# EAGLE design Character ID Transmiter xbee (EAGLE 6.4)
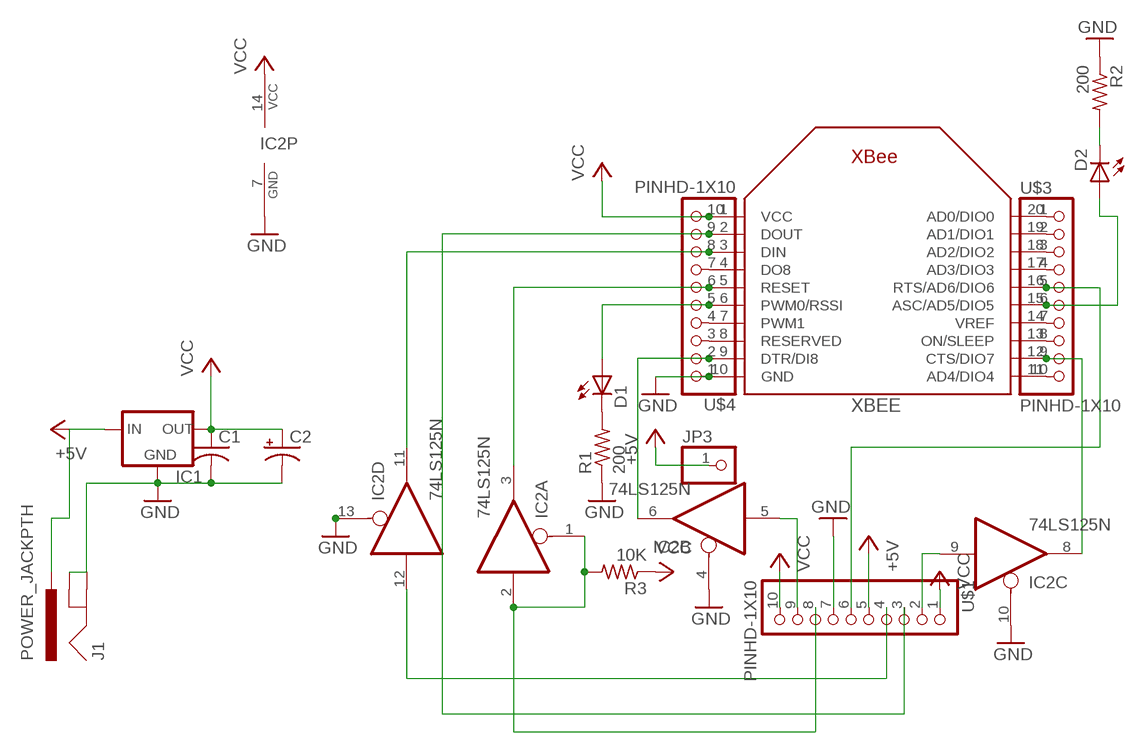
[diagram p0: schematic, sheet 1]

## Parts
C1  C-US025-025X050  [C025-025X050]
C2  CPOL-USE2.5-5  [E2,5-5]
D1  LED3MM  [LED3MM]
D2  LED3MM  [LED3MM]
IC1  MC1700  [TO92]
IC2  74LS125N  [DIL14]
J1  POWER_JACKPTH  [POWER_JACK_PTH]
JP3  PINHD-1X1  [1X01]
R1  200  R-US_0207/10  [0207/10]
R2  200  R-US_0207/10  [0207/10]
R3  10K  R-US_0207/10  [0207/10]
U$1  PINHD-1X10  [1X10-BIG]
U$3  PINHD-1X10  [1X10-BIG]
U$4  PINHD-1X10  [1X10-BIG]
XBEE  XBEE  [XBEE]

## Nets
+5V: IC1.2(IN) J1.PWR JP3.1 U$1.5
GND: C1.2 C2.- IC1.1(GND) IC2.4(B:OE) IC2.7(P:GND) IC2.10(C:OE) IC2.13(D:OE) J1.GND J1.GNDBREAK R1.1 R2.1 U$1.7 U$4.1 XBEE.10(GND)
N$1: IC2.12(D:I) U$1.4
N$2: IC2.11(D:O) U$4.8 XBEE.3(DIN)
N$3: IC2.5(B:I) U$1.9
N$4: IC2.8(C:O) U$3.9 XBEE.12(CTS/DIO7)
N$5: D2.K(C) R2.2
N$6: U$4.7 XBEE.4(DO8)
N$7: D1.A U$4.5 XBEE.6(PWM0/RSSI)
N$8: D1.K(C) R1.2
N$9: D2.A U$3.6 XBEE.15(ASC/AD5/DIO5)
N$10: IC2.6(B:O) U$4.2 XBEE.9(DTR/DI8)
N$11: U$4.3 XBEE.8(RESERVED)
N$12: U$4.4 XBEE.7(PWM1)
N$13: IC2.3(A:O) U$4.6 XBEE.5(RESET)
N$14: U$3.1 XBEE.20(AD0/DIO0)
N$15: U$3.2 XBEE.19(AD1/DIO1)
N$16: U$3.3 XBEE.18(AD2/DIO2)
N$17: U$3.4 XBEE.17(AD3/DIO3)
N$18: U$3.7 XBEE.14(VREF)
N$19: U$3.8 XBEE.13(ON/SLEEP)
N$20: U$3.10 XBEE.11(AD4/DIO4)
N$21: IC2.9(C:I) U$1.2
RESET: IC2.1(A:OE) IC2.2(A:I) R3.2 U$1.8
RTS: U$1.6 U$3.5 XBEE.16(RTS/AD6/DIO6)
TX: U$1.3 U$4.9 XBEE.2(DOUT)
VCC: C1.1 C2.+ IC1.3(OUT) IC2.14(P:VCC) R3.1 U$1.1 U$1.10 U$4.10 XBEE.1(VCC)

## Library data of the parts
C1 = rcl-ez:C-US: CAPACITOR, American symbol
C2 = rcl-ez:CPOL-US: POLARIZED CAPACITOR, American symbol
D1 D2 = minimidi:LED: LED OSRAM: - CHIPLED LG R971, LG N971, LY N971, LG Q971, LY Q971, LO R971, LY R971 LH N974, LH R974 LS Q976, LO Q976, LY Q976 LO Q996 - Hyper CHIPLED LW Q18S LB Q993, LB Q99A, LB R99A - SideLED LS A670, LO A670, LY A670, LG A670, LP A670 LB A673, LV A673, LT A673, LW A673 LH A674 LY A675 LS A676, LA A676, LO A676, LY A676, LW A676 LS A679, LY A679, LG A679 - Hyper Micro SIDELED® LS Y876, LA Y876, LO Y876, LY Y876 LT Y87S - SmartLED LW L88C, LW L88S LB L89C, LB L89S, LG L890 LS L89K, LO L89K, LY L89K LS L896, LA L896, LO L896, LY L896 - TOPLED LS T670, LO T670, LY T670, LG T670, LP T670 LSG T670, LSP T670, LSY T670, LOP T670, LYG T670 LG T671, LOG T671, LSG T671 LB T673, LV T673, LT T673, LW T673 LH T674 LS T676, LA T676, LO T676, LY T676, LB T676, LH T676, LSB T676, LW T676 LB T67C, LV T67C, LT T67C, LS T67K, LO T67K, LY T67K, LW E67C LS E67B, LA E67B, LO E67B, LY E67B, LB E67C, LV E67C, LT E67C LW T67C LS T679, LY T679, LG T679 LS T770, LO T770, LY T770, LG T770, LP T770 LB T773, LV T773, LT T773, LW T773 LH T774 LS E675, LA E675, LY E675, LS T675 LS T776, LA T776, LO T776, LY T776, LB T776 LHGB T686 LT T68C, LB T68C - Hyper Mini TOPLED® LB M676 - Mini TOPLED Santana® LG M470 LS M47K, LO M47K, LY M47K Source: http://www.osram.convergy.de/
IC1 = ulink:MC1700: VOLTAGE REGULATOR
IC2 = 74xx-us:74*125: Quad bus BUFFER, 3-state
J1 = SparkFun-Connectors:POWER_JACK: Power Jack This is the standard 5.5mm barrel jack for power. The PTH is the most common, proven, reliable, footprint. All others are experimental. The Slot footprint only works if the mill layer is transmitted to the PCB fab house so be warned. Spark Fun Electronics SKU : PRT-00119. Mating wall wart : TOL-00298 (and others)
JP3 = digg:PINHD-1X1: PIN HEADER
R1-R3 = rcl-ez:R-US_: RESISTOR, American symbol
U$1 U$3 U$4 = ybox2:PINHD-1X10
XBEE = ulink:XBEE

## Board
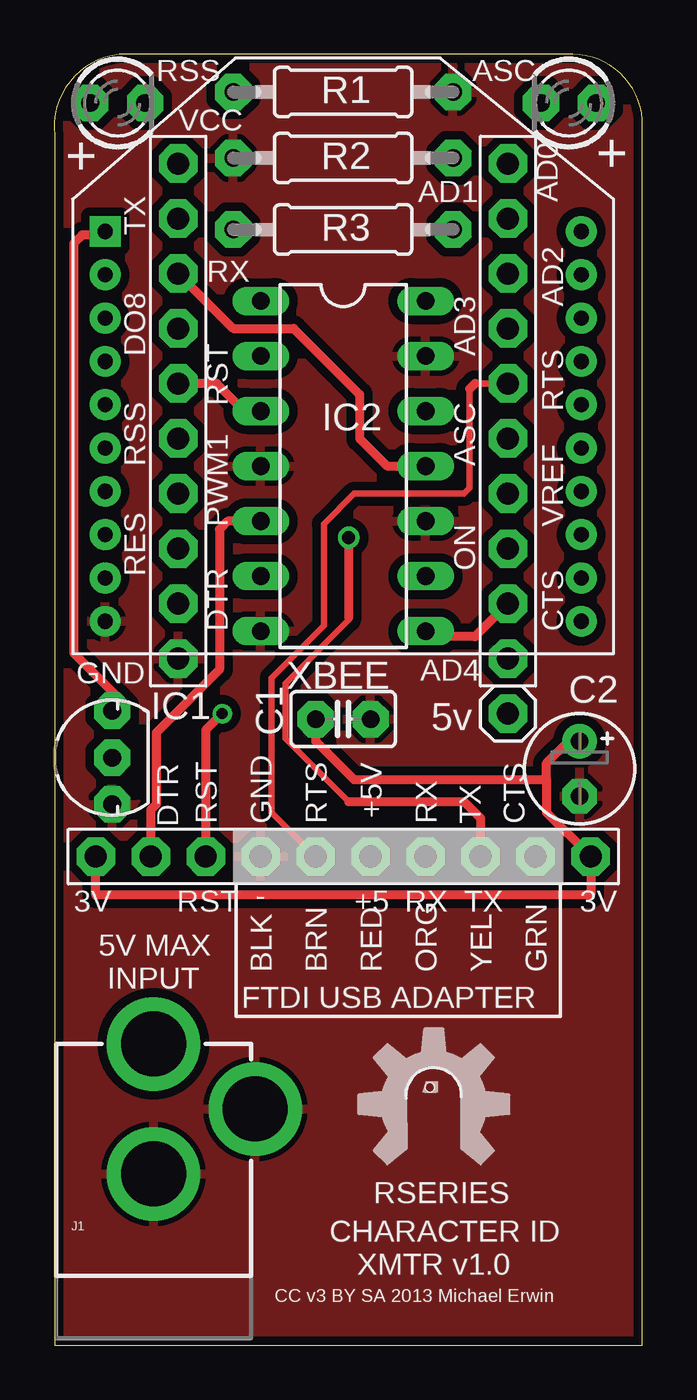
[diagram p1: board, top side]
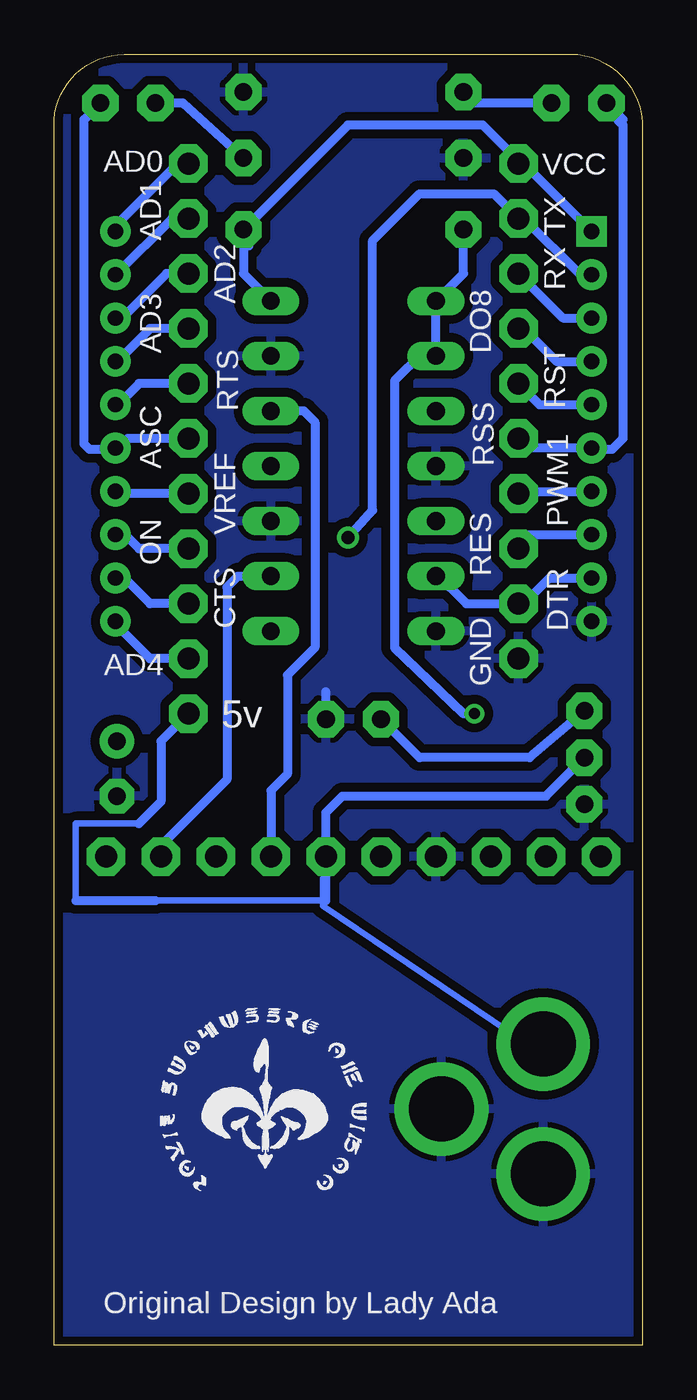
[diagram p2: board, bottom side, seen from below]

Size 27.18 x 59.62 mm. Coordinates in mm from the lower left corner, seen from the top.
Outline: 0.02,0 27.18,0 27.18,56.59 arc90 23.65,59.61 3,59.61 arc90 0.02,55.88 0.02,0
Copper layers (1*16): Top 0.035mm / dielectric 1.5mm / Bottom 0.035mm
Design rules "default": minimum track width 12mil, minimum drill 19mil, track to track 12mil, track to pad 12mil, pad to pad 12mil, via to via 12mil, smd to smd 0mil, copper to edge 10mil, drill to drill 8mil, minimum pad ring 10mil, minimum via ring 8mil, stop-mask expansion 4mil, vias tented up to drill 0mil, thermal gap 10mil

### Footprints (pad centres in the part's own frame; a part is rotated, then mirrored left to right if it is on the bottom)
C025-025X050 = drill 0.813 pad 1.676 octagon: 1 -1.27,0; 2 1.27,0
E2,5-5 = drill 0.813 pad 1.6: + -1.27,0 | drill 0.813 pad 1.6 octagon: - 1.27,0
LED3MM = drill 0.813 pad 1.676 octagon: A -1.27,0; K 1.27,0
TO92 = drill 0.813 pad 1.676 octagon: 1 -2.159,0; 2 0,0; 3 2.159,0
DIL14 = drill 0.813 long: 1 -7.62,-3.81; 2 -5.08,-3.81; 3 -2.54,-3.81; 4 0,-3.81; 5 2.54,-3.81; 6 5.08,-3.81; 7 7.62,-3.81; 8 7.62,3.81; 9 5.08,3.81; 10 2.54,3.81; 11 0,3.81; 12 -2.54,3.81; 13 -5.08,3.81; 14 -7.62,3.81
POWER_JACK_PTH = drill 2.997 pad 4.318: GND 0,7.7; GNDBREAK 4.7,10.7; PWR 0,13.7
1X01 = drill 1.016 pad 1.778 octagon: 1 0,0
0207/10 = drill 0.813 pad 1.676 octagon: 1 -5.08,0; 2 5.08,0
1X10-BIG = drill 1.016 pad 1.778 octagon: 1 -11.43,0; 2 -8.89,0; 3 -6.35,0; 4 -3.81,0; 5 -1.27,0; 6 1.27,0; 7 3.81,0; 8 6.35,0; 9 8.89,0; 10 11.43,0
XBEE = drill 0.7 pad 1.422 square: 1 -11,5.5 | drill 0.7 pad 1.422: 2 -11,3.5; 3 -11,1.5; 4 -11,-0.5; 5 -11,-2.5; 6 -11,-4.5; 7 -11,-6.5; 8 -11,-8.5; 9 -11,-10.5; 10 -11,-12.5; 11 11,-12.5; 12 11,-10.5; 13 11,-8.5; 14 11,-6.5; 15 11,-4.5; 16 11,-2.5; 17 11,-0.5; 18 11,1.5; 19 11,3.5; 20 11,5.5

### Placement (x,y rotation side)
C1  13.35,28.92 0 top
C2  24.27,26.63 270 top
D1  2.94,57.37 0 top
D2  23.77,57.37 180 top
IC1  2.68,27.14 90 top
IC2  13.35,40.6 270 top
J1  4.59,0.22 0 top
JP3  20.97,29.17 0 top
R1  13.35,57.87 180 top
R2  13.35,54.83 0 top
R3  13.35,51.52 180 top
U$1  13.35,22.57 180 top
U$2  [RSERIES-OSHW-LOGO-LARGE]  17.54,11.14 0 top
U$3  20.97,43.14 270 top
U$4  5.73,43.14 90 top
U$5  [ROYAL-ENGINEERS-OF-NABOO-SMALL]  22.37,6.82 0 bottom
XBEE  13.35,45.94 0 top

### Tracks (layer width: path | path; a pad name or v marks a point on that pad's centre or on a via)
+5V
  Top 0.152: J1.PWR 4.84,13.92 4.84,13.93
  Bottom 0.305: JP3.1 21.48,28.66 | 22.5,20.54 14.62,20.54 | 23.26,24.09 26.18,24.09 26.18,20.54 | J1.PWR 5.35,13.93 14.75,20.28 14.75,21.55 14.62,21.55
  Bottom 0.406: 14.62,20.54 14.62,21.55 U$1.5 14.62,24.6 13.86,25.36 4.46,25.36 IC1.2 | 21.48,28.66 22.24,27.9 22.24,25.11 23.26,24.09 | 26.18,20.54 22.5,20.54
GND
  Bottom 0.406: C1.2 14.62,30.19
  pour Bottom (isolate 0.406): 0.14,-0.04 27.32,-0.04 27.32,59.65 -0.11,59.65
  pour Top (isolate 0.406): 0.14,-0.04 27.32,-0.04 27.32,59.65 -0.11,59.65
N$1
  Bottom 0.406: IC2.12 15.64,43.14 15.13,42.63 15.13,32.22 16.4,30.95 16.4,26.38 17.16,25.62 U$1.4
N$2
  Top 0.406: 17.42,40.6 IC2.11 15.38,40.6 14.11,41.87 14.11,43.9 11.07,46.95 8.27,46.95 U$4.8
  Bottom 0.406: XBEE.3 3.68,47.44 U$4.8
N$3
  Top 0.406: IC2.5 8.02,38.06 7.64,37.68 7.64,31.2 4.72,28.28 4.72,24.98 4.46,24.73 U$1.9
N$4
  Top 0.406: IC2.8 17.42,32.73 19.45,32.73 U$3.9
  Bottom 0.406: XBEE.12 24.11,35.44 24.02,35.52 22.75,34.25 U$3.9
N$5
  Bottom 0.406: R2.2 21.23,57.37 D2.K
N$6
  Bottom 0.406: XBEE.4 3.96,45.44 5.48,46.95 5.48,47.21 5.73,47.21 | 5.99,47.21 5.73,47.21 | 5.73,47.21 U$4.7
N$7
  Bottom 0.406: 1.03,56.73 0.91,56.6 | D1.A 1.03,56.73 | U$4.5 5.3,41.44 XBEE.6 2.28,41.36 1.41,41.36 0.91,41.87 0.91,56.35 1.16,56.6 1.03,56.73
N$8
  Bottom 0.406: R1.2 8.02,57.37 D1.K
N$9
  Bottom 0.406: D2.A 25.8,56.6 25.8,41.62 25.54,41.36 24.42,41.36 XBEE.15 24.27,41.36 23.77,41.87 U$3.6
N$10
  Bottom 0.406: XBEE.9 4.29,35.44 5.48,34.25 U$4.2 8.14,34.25 9.54,35.65 IC2.6
N$11
  Bottom 0.406: U$4.3 5.99,36.79 5.34,37.44 XBEE.8
N$12
  Bottom 0.406: XBEE.7 5.63,39.44 U$4.4
N$13
  Top 0.406: U$4.6 7.51,44.41 8.78,43.14 IC2.3
  Bottom 0.406: XBEE.5 4.76,43.44 U$4.6
N$14
  Bottom 0.406: XBEE.20 24.44,51.44 24.53,51.52 21.48,54.57 U$3.1
N$15
  Bottom 0.406: XBEE.19 24.33,49.44 21.73,52.03 U$3.2
N$16
  Bottom 0.406: XBEE.18 24.35,47.28 24.27,47.21 21.99,49.49 U$3.3
N$17
  Bottom 0.406: XBEE.17 24.28,45.44 24.27,45.43 22.75,46.95 U$3.4
N$18
  Bottom 0.406: XBEE.14 24.35,39.51 24.27,39.59 24.02,39.33 U$3.7
N$19
  Bottom 0.406: XBEE.13 24.14,37.44 24.02,37.55 23.26,36.79 U$3.8
N$20
  Bottom 0.406: 24.47,33.44 24.53,33.49 | 24.47,33.44 XBEE.11 | U$3.10 22.75,31.71 24.47,33.44
N$21
  Bottom 0.406: IC2.9 18.69,35.52 19.19,35.01 19.19,26.12 22.24,23.08 U$1.2
RESET  (via drill 0.5)
  Top 0.406: v7.76,29.17 7,28.41 U$1.8
  Bottom 0.406: v7.76,29.17 8.27,29.17 11.45,32.22 11.45,44.54 10.18,45.81 9.67,45.81 IC2.2 | IC2.2 9.03,45.68 | 8.27,51.65 R3.2 8.27,49.49 IC2.1 IC2.2
RTS
  Top 0.305: 19.19,44.16 19.19,39.59 18.94,39.33 13.86,39.33 12.46,37.94 12.46,33.24 10.05,30.82 10.05,24.6 U$1.6 | 19.45,44.41 U$3.5
  Top 0.406: 19.19,44.16 19.45,44.41
  Bottom 0.406: XBEE.16 24.31,43.44 24.27,43.4 23.26,44.41 U$3.5
TX  (via drill 0.6)
  Top 0.305: 13.61,25.11 10.68,28.03 10.68,30.57 13.61,33.49 13.61,33.62
  Top 0.406: v13.61,37.3 13.61,33.62 | 13.61,25.11 18.94,25.11 19.7,24.35 U$1.3
  Bottom 0.406: U$4.9 5.48,52.03 2.88,49.44 XBEE.2 | U$4.9 5.86,52.54 | v13.61,37.3 12.46,38.57 12.46,51.02 10.3,53.18 6.87,53.18 U$4.9
VCC
  Top 0.406: IC1.3 3.19,29.68 0.91,31.97 0.91,50.89 1.29,51.27 2.52,51.27 | C1.1 12.08,27.9 13.86,26.12 22.75,26.12 | 22.75,26.12 22.75,24.6 U$1.1 24.78,20.79 1.92,20.79 U$1.10 | 22.75,26.12 22.75,26.89 23.77,27.9 C2.+ | 2.52,51.27 2.68,51.27 | XBEE.1 2.52,51.27
  Bottom 0.406: IC1.3 5.22,27.14 10.3,27.14 C1.1 | 5.99,54.57 U$4.10 | XBEE.1 5.49,54.57 5.99,54.57 | R3.1 18.18,50.76 | IC2.14 18.43,49.49 R3.1 | 5.99,54.57 5.99,54.95 7.38,56.35 13.61,56.35 R3.1

### Text on the board
tPlace: DTR | RST | GND | RTS | +5V | RX | TX | 3V | 3V | 5V MAX / INPUT | BLK | BRN | RED | ORG | YEL | GRN | FTDI USB ADAPTER | RSERIES | CHARACTER ID | XMTR v1.0 | CC v3 BY SA 2013 Michael Erwin
bPlace: Original Design by Lady Ada
tNames: ASC | RSS | VCC | + | AD1 | + | AD0 | TX | RX | AD2 | DO8 | AD3 | RST | RTS | RSS | ASC | PWM1 | VREF | RES | ON | DTR | CTS | GND | AD4 | 5v | CTS | RST | RX | - | +5 | TX
bNames: VCC | AD0 | TX | AD1 | RX | AD2 | DO8 | AD3 | RST | RTS | RSS | ASC | PWM1 | VREF | RES | ON | DTR | CTS | AD4 | GND | 5v